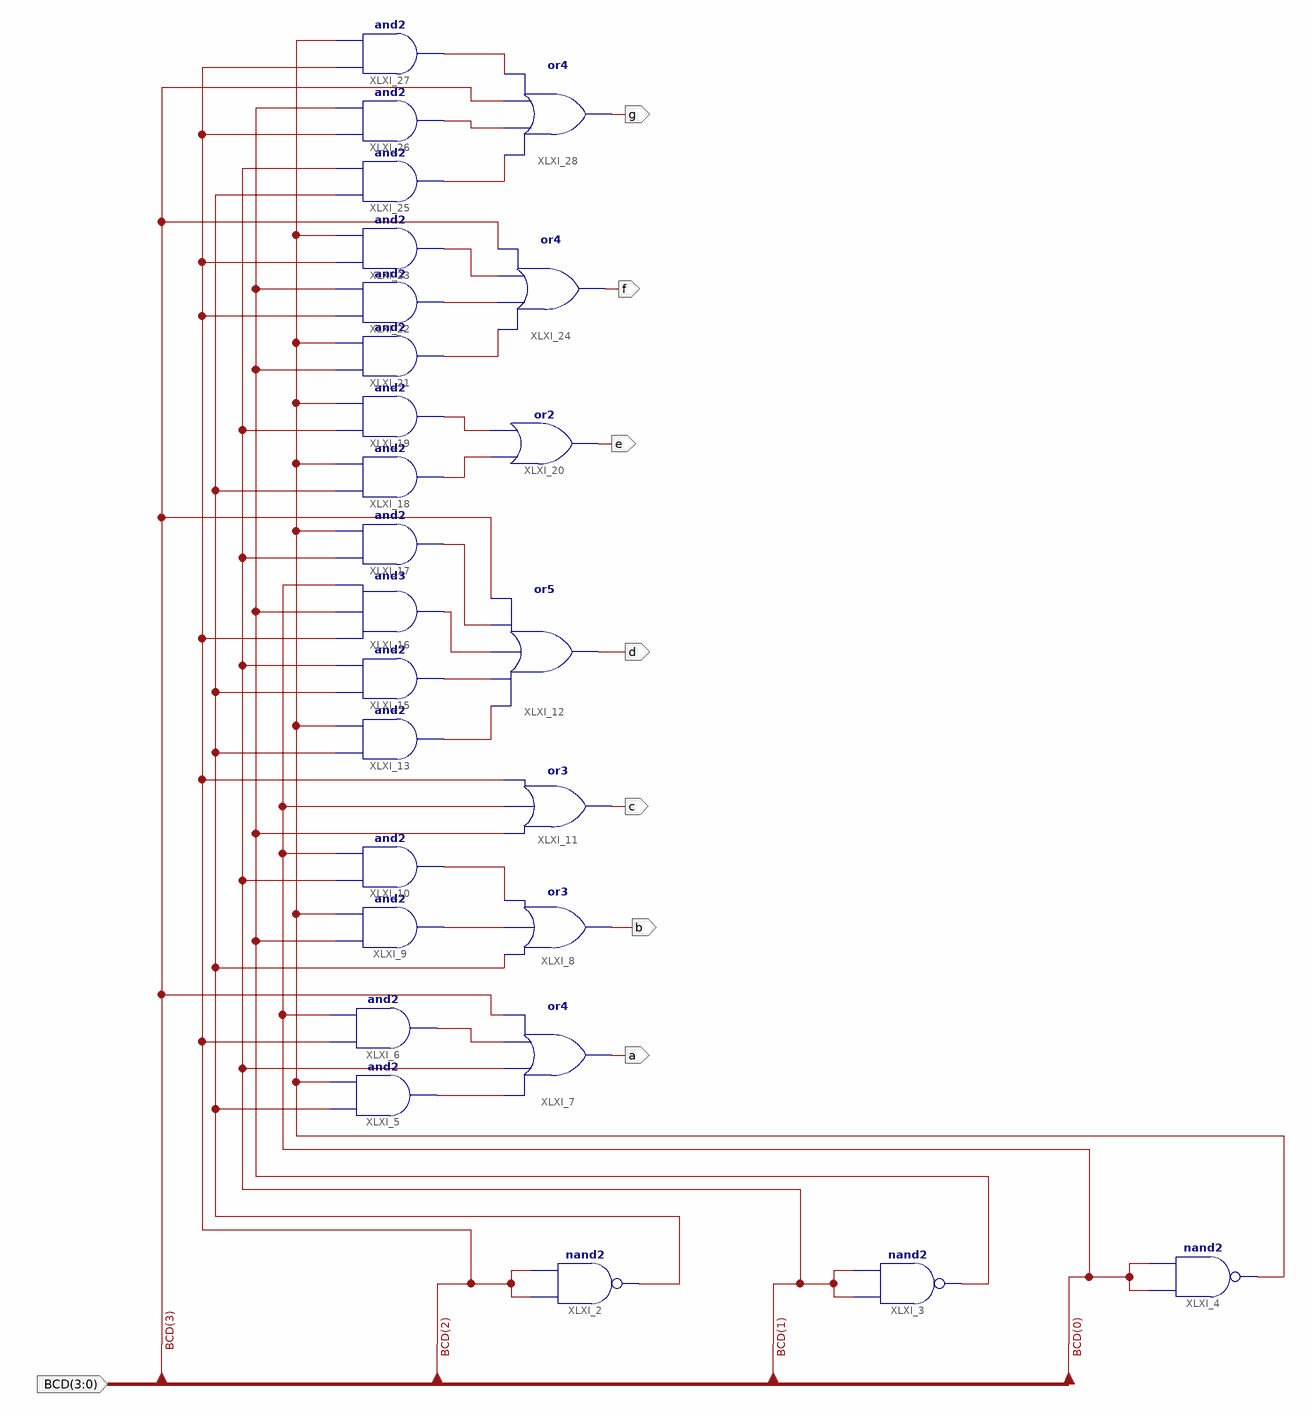
[diagram p0: schematic sheet 1]
// Xilinx ISE schematic decoder.sch (spartan6) as structural Verilog: 26 symbols, 8 ports
module decoder (
  input  [3:0] BCD,
  output a,
  output b,
  output c,
  output d,
  output e,
  output f,
  output g
);

  wire XLXN_7, XLXN_10, XLXN_13, XLXN_14, XLXN_15, XLXN_19, XLXN_20, XLXN_32, XLXN_33, XLXN_34, XLXN_37,
       XLXN_40, XLXN_41, XLXN_44, XLXN_45, XLXN_46, XLXN_48, XLXN_49, XLXN_50;

  nand XLXI_2 (XLXN_7, BCD[2], BCD[2]);
  nand XLXI_3 (XLXN_10, BCD[1], BCD[1]);
  nand XLXI_4 (XLXN_13, BCD[0], BCD[0]);
  and XLXI_5 (XLXN_14, XLXN_7, XLXN_13);
  or XLXI_7 (a, XLXN_14, BCD[1], XLXN_15, BCD[3]);
  and XLXI_6 (XLXN_15, BCD[2], BCD[0]);
  and XLXI_9 (XLXN_19, XLXN_10, XLXN_13);
  and XLXI_10 (XLXN_20, BCD[1], BCD[0]);
  or XLXI_8 (b, XLXN_7, XLXN_19, XLXN_20);
  or XLXI_11 (c, XLXN_10, BCD[0], BCD[2]);
  and XLXI_13 (XLXN_32, XLXN_7, XLXN_13);
  and XLXI_15 (XLXN_33, XLXN_7, BCD[1]);
  and XLXI_16 (XLXN_34, BCD[2], XLXN_10, BCD[0]);
  or XLXI_12 (d, XLXN_32, XLXN_33, XLXN_34, XLXN_37, BCD[3]);
  and XLXI_17 (XLXN_37, BCD[1], XLXN_13);
  and XLXI_18 (XLXN_41, XLXN_7, XLXN_13);
  and XLXI_19 (XLXN_40, BCD[1], XLXN_13);
  or XLXI_20 (e, XLXN_41, XLXN_40);
  and XLXI_21 (XLXN_44, XLXN_10, XLXN_13);
  and XLXI_22 (XLXN_45, BCD[2], XLXN_10);
  and XLXI_23 (XLXN_46, BCD[2], XLXN_13);
  or XLXI_24 (f, XLXN_44, XLXN_45, XLXN_46, BCD[3]);
  and XLXI_25 (XLXN_50, XLXN_7, BCD[1]);
  and XLXI_26 (XLXN_49, BCD[2], XLXN_10);
  and XLXI_27 (XLXN_48, BCD[2], XLXN_13);
  or XLXI_28 (g, XLXN_50, XLXN_49, BCD[3], XLXN_48);
endmodule
